# EAGLE design shiitakevmctl (EAGLE 8.2.1)
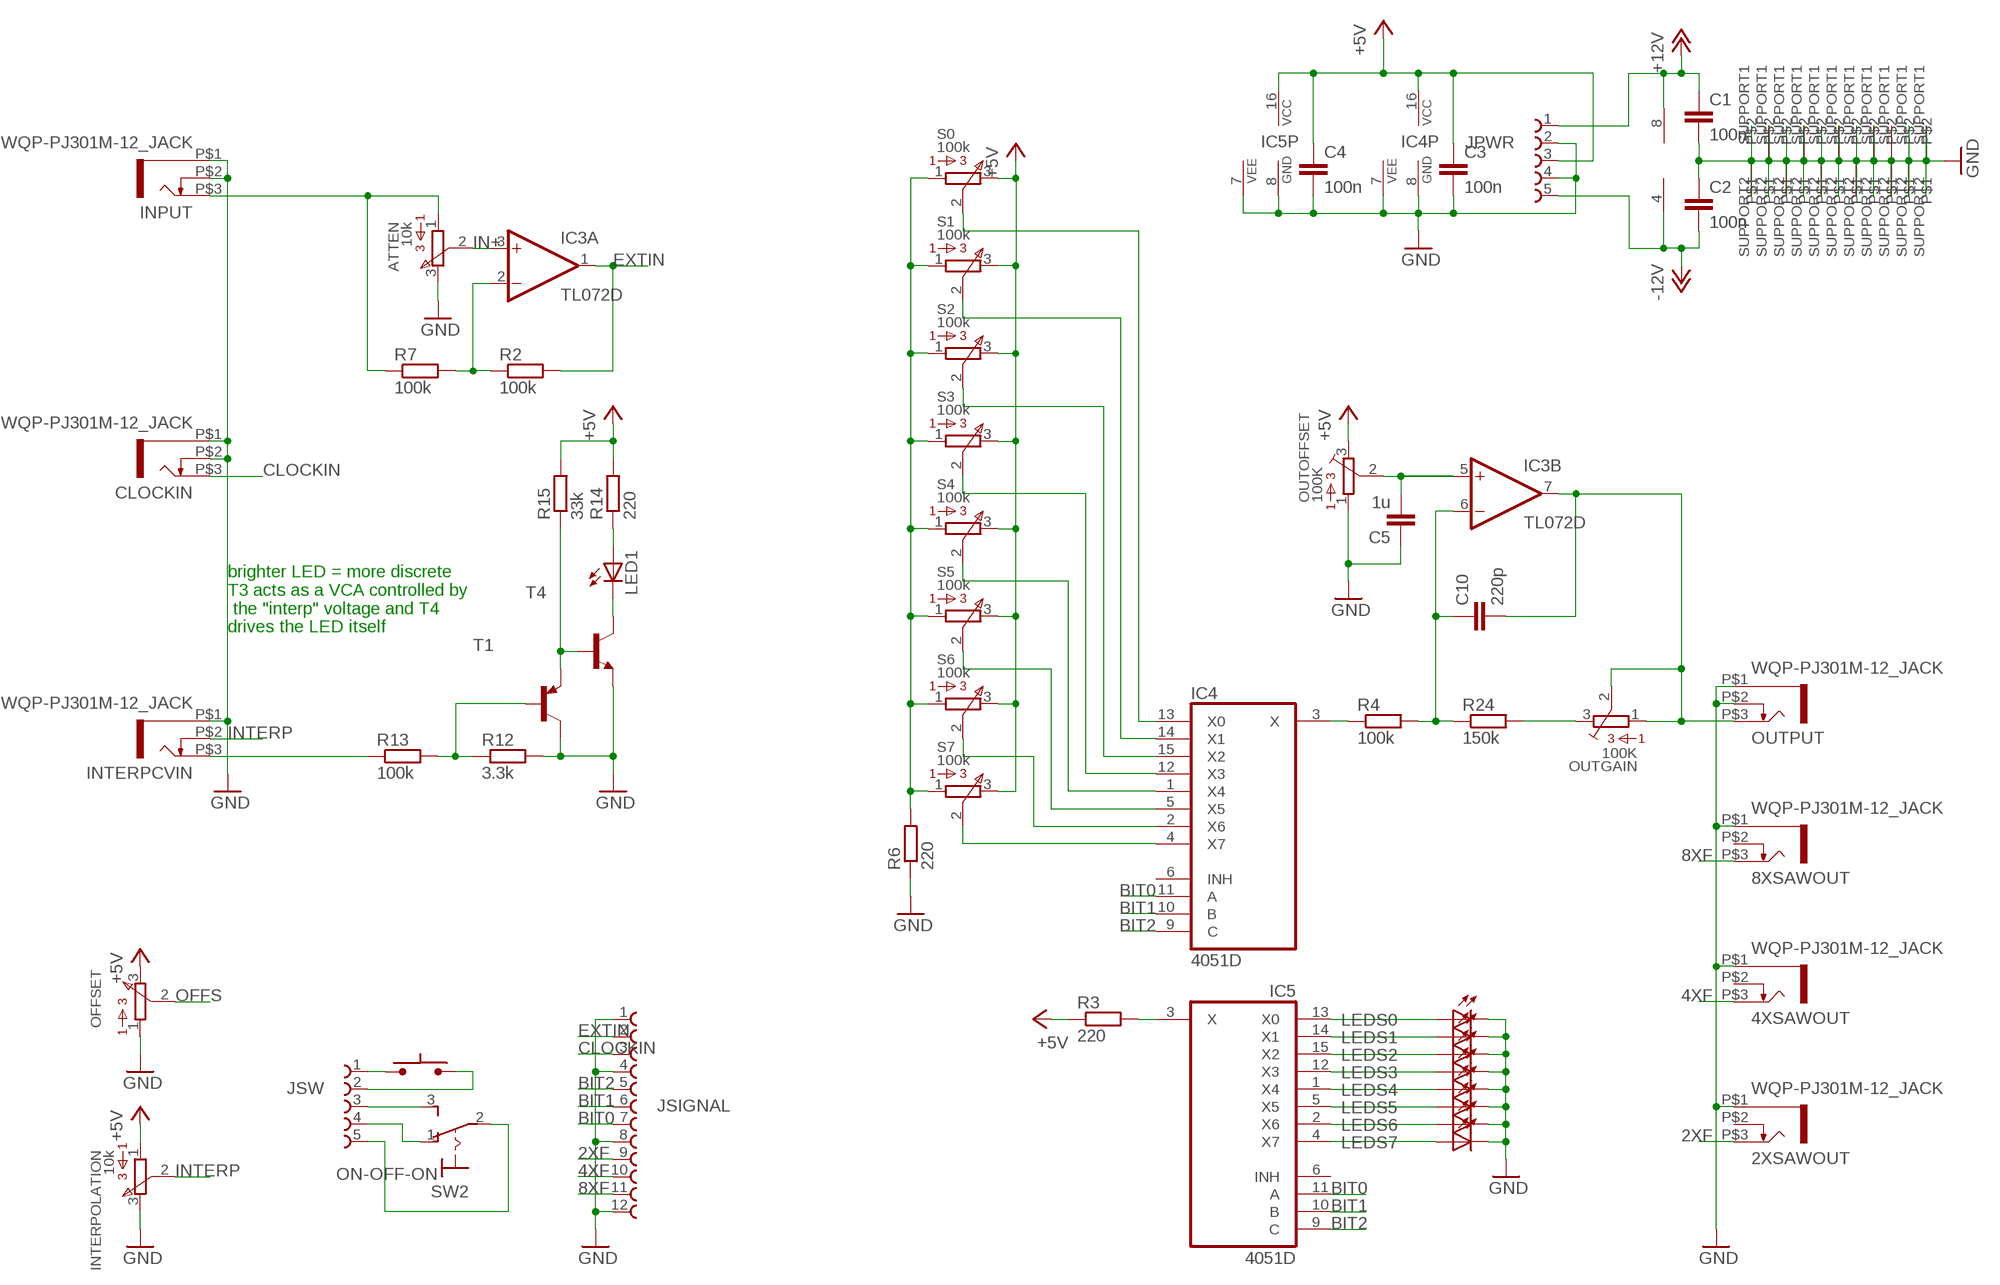
[diagram p0: schematic, sheet 1]

## Parts
2XSAWOUT  WQP-PJ301M-12_JACK  [WQP-PJ301M-12_JACK]
4XSAWOUT  WQP-PJ301M-12_JACK  [WQP-PJ301M-12_JACK]
8XSAWOUT  WQP-PJ301M-12_JACK  [WQP-PJ301M-12_JACK]
ATTEN  10k  308/309  [308]
C1  100n  C-EUC1206  [C1206]
C2  100n  C-EUC1206  [C1206]
C3  100n  C-EUC1206  [C1206]
C4  100n  C-EUC1206  [C1206]
C5  1u  C-EUC1206  [C1206]
C10  220p  C-EUC1206  [C1206]
CLOCKIN  WQP-PJ301M-12_JACK  [WQP-PJ301M-12_JACK]
IC3  TL072D  [SO08]
IC4  4051D  [SO16]
IC5  4051D  [SO16]
INPUT  WQP-PJ301M-12_JACK  [WQP-PJ301M-12_JACK]
INTERPCVIN  WQP-PJ301M-12_JACK  [WQP-PJ301M-12_JACK]
INTERPOLATION  10k  308/309  [308]
JPWR  61300511121  [61300511121]
JSIGNAL  61301211121  [61301211121]
JSW  61300511121  [61300511121]
LED1  LEDCHIPLED_0805  [CHIPLED_0805]
LEDS0  LED3MM  [LED3MM]
LEDS1  LED3MM  [LED3MM]
LEDS2  LED3MM  [LED3MM]
LEDS3  LED3MM  [LED3MM]
LEDS4  LED3MM  [LED3MM]
LEDS5  LED3MM  [LED3MM]
LEDS6  LED3MM  [LED3MM]
LEDS7  LED3MM  [LED3MM]
OFFSET  308/309  [308]
OUTGAIN  100K  3386-C  [3386C]
OUTOFFSET  100K  3386-C  [3386C]
OUTPUT  WQP-PJ301M-12_JACK  [WQP-PJ301M-12_JACK]
R2  100k  R-EU_R1206  [R1206]
R3  220  R-EU_R1206  [R1206]
R4  100k  R-EU_R1206  [R1206]
R6  220  R-EU_R1206  [R1206]
R7  100k  R-EU_R1206  [R1206]
R12  3.3k  R-EU_R1206  [R1206]
R13  100k  R-EU_R1206  [R1206]
R14  220  R-EU_R1206  [R1206]
R15  33k  R-EU_R1206  [R1206]
R24  150k  R-EU_R1206  [R1206]
S0  100k  308/309  [308]
S1  100k  308/309  [308]
S2  100k  308/309  [308]
S3  100k  308/309  [308]
S4  100k  308/309  [308]
S5  100k  308/309  [308]
S6  100k  308/309  [308]
S7  100k  308/309  [308]
SW1  PUSHSWITCH  [PUSHSWITCH]
SW2  ON-OFF-ON  320-916  [320-916]
T1  MMBT3906LT1-PNP-SOT23-BEC  [SOT23-BEC]
T4  MMBT3904LT1-NPN-SOT23-BEC  [SOT23-BEC]

## Nets
2XF: 2XSAWOUT.P$3 JSIGNAL.9
4XF: 4XSAWOUT.P$3 JSIGNAL.10
8XF: 8XSAWOUT.P$3 JSIGNAL.11
+5V: C3.1 C4.1 IC4.16(VCC) IC5.16(VCC) INTERPOLATION.1 JPWR.3 OFFSET.3 OUTOFFSET.3 R3.1 R14.2 R15.2 S0.3 S1.3 S2.3 S3.3 S4.3 S5.3 S6.3 S7.3
+12V: C1.1 IC3.8(P:V+) JPWR.1
-12V: C2.2 IC3.4(P:V-) JPWR.5
BIT0: IC4.11(A) IC5.11(A) JSIGNAL.7
BIT1: IC4.10(B) IC5.10(B) JSIGNAL.6
BIT2: IC4.9(C) IC5.9(C) JSIGNAL.5
CLOCKIN: CLOCKIN.P$3 JSIGNAL.3
EXTIN: IC3.1(A:OUT) JSIGNAL.2 R2.2
GND: 2XSAWOUT.P$1 4XSAWOUT.P$1 8XSAWOUT.P$1 ATTEN.3 ATTEN.SUPPORT2 C1.2 C2.1 C3.2 C4.2 C5.1 CLOCKIN.P$1 CLOCKIN.P$2 IC4.7(VEE) IC4.8(GND) IC5.7(VEE) IC5.8(GND) INPUT.P$1 INPUT.P$2 INTERPCVIN.P$1 INTERPOLATION.3 INTERPOLATION.SUPPORT1 INTERPOLATION.SUPPORT2 JPWR.2 JPWR.4 JSIGNAL.1 JSIGNAL.4 JSIGNAL.8 JSIGNAL.12 LEDS0.K(C) LEDS1.K(C) LEDS2.K(C) LEDS3.K(C) LEDS4.K(C) LEDS5.K(C) LEDS6.K(C) LEDS7.K(C) OFFSET.1 OFFSET.SUPPORT1 OFFSET.SUPPORT2 OUTOFFSET.1 OUTPUT.P$1 OUTPUT.P$2 R6.1 R12.2 S0.SUPPORT1 S0.SUPPORT2 S1.SUPPORT1 S1.SUPPORT2 S2.SUPPORT1 S2.SUPPORT2 S3.SUPPORT1 S3.SUPPORT2 S4.SUPPORT1 S4.SUPPORT2 S5.SUPPORT1 S5.SUPPORT2 S6.SUPPORT1 S6.SUPPORT2 S7.SUPPORT1 S7.SUPPORT2 T1.C T4.E
IN+: ATTEN.2 IC3.3(A:+IN)
INTERP: INTERPCVIN.P$2 INTERPOLATION.2
N$1: C10.1 IC3.6(B:-IN) R4.2 R24.1
N$2: C10.2 IC3.7(B:OUT) OUTGAIN.1 OUTGAIN.2 OUTPUT.P$3
N$3: ATTEN.1 INPUT.P$3 R7.1
N$4: IC4.13(X0) S0.2
N$5: IC4.14(X1) S1.2
N$6: IC4.15(X2) S2.2
N$7: IC4.12(X3) S3.2
N$8: IC4.1(X4) S4.2
N$9: IC4.5(X5) S5.2
N$10: IC4.2(X6) S6.2
N$11: IC4.4(X7) S7.2
N$12: IC4.3(X) R4.1
N$13: IC3.2(A:-IN) R2.1 R7.2
N$14: IC5.3(X) R3.2
N$15: R6.2 S0.1 S1.1 S2.1 S3.1 S4.1 S5.1 S6.1 S7.1
N$16: R15.1 T1.E T4.B
N$17: LED1.C T4.C
N$18: R12.1 R13.2 T1.B
N$19: INTERPCVIN.P$3 R13.1
N$20: LED1.A R14.1
N$21: JSW.1 SW1.P$1
N$22: JSW.2 SW1.P$2
N$23: JSW.4 SW2.1(O)
N$24: JSW.3 SW2.3(S)
N$25: JSW.5 SW2.2(P)
N$26: C5.2 IC3.5(B:+IN) OUTOFFSET.2
N$27: IC5.13(X0) LEDS0.A
N$28: IC5.14(X1) LEDS1.A
N$29: IC5.15(X2) LEDS2.A
N$30: IC5.12(X3) LEDS3.A
N$31: IC5.1(X4) LEDS4.A
N$32: IC5.5(X5) LEDS5.A
N$33: IC5.4(X7) LEDS7.A
N$34: IC5.2(X6) LEDS6.A
N$51: OUTGAIN.3 R24.2
OFFS: OFFSET.2
Unconnected: 2XSAWOUT.P$2 4XSAWOUT.P$2 8XSAWOUT.P$2 ATTEN.SUPPORT1 IC4.6(INH) IC5.6(INH)

## Notes on the sheet
- brighter LED = more discrete
  T3 acts as a VCA controlled by
   the "interp" voltage and T4
  drives the LED itself

## Library data of the parts
2XSAWOUT 4XSAWOUT 8XSAWOUT CLOCKIN INPUT INTERPCVIN OUTPUT = thonkiconn:WQP-PJ301M-12_JACK
ATTEN INTERPOLATION OFFSET S0 S1-S7 = bourns:308/309: 308/309 Series Potentiometer
C1-C5 C10 = resistor:C-EU: CAPACITOR, European symbol
IC3 = linear:TL072: OP AMP
IC4 IC5 = 40xx:4051: 8-channel ANALOG MULTIPLEXER
JPWR JSW = Board-to-Board (rev17e):61300511121: WR-PHD 2.54mm Pin Header, 5 Pin =>Code : Con_BTB_PHD_2.54_1_THT_61300511121 <http://katalog.we-online.de/media/images/eican/Con_BTB_PHD_2.54_1_THT_6130xx11121_pf2.jpg> Details see: http://katalog.we-online.de/en/em/613_0xx_111_21 Created 2014-05-29, Karrer Zheng 2014 (C) Würth Elektronik
JSIGNAL = Board-to-Board (rev17e):61301211121: WR-PHD 2.54mm Pin Header, 12 Pins =>Code : Con_BTB_PHD_2.54_1_THT_61301211121 <http://katalog.we-online.de/media/images/eican/Con_BTB_PHD_2.54_1_THT_6130xx11121_pf2.jpg> Details see: http://katalog.we-online.de/en/em/613_0xx_111_21 Created 2014-05-29, Karrer Zheng 2014 (C) Würth Elektronik
LED1 LEDS0 LEDS1-LEDS7 = led:LED: LED OSRAM: - CHIPLED LG R971, LG N971, LY N971, LG Q971, LY Q971, LO R971, LY R971 LH N974, LH R974 LS Q976, LO Q976, LY Q976 LO Q996 - Hyper CHIPLED LW Q18S LB Q993, LB Q99A, LB R99A - SideLED LS A670, LO A670, LY A670, LG A670, LP A670 LB A673, LV A673, LT A673, LW A673 LH A674 LY A675 LS A676, LA A676, LO A676, LY A676, LW A676 LS A679, LY A679, LG A679 - Hyper Micro SIDELED® LS Y876, LA Y876, LO Y876, LY Y876 LT Y87S - SmartLED LW L88C, LW L88S LB L89C, LB L89S, LG L890 LS L89K, LO L89K, LY L89K LS L896, LA L896, LO L896, LY L896 - TOPLED LS T670, LO T670, LY T670, LG T670, LP T670 LSG T670, LSP T670, LSY T670, LOP T670, LYG T670 LG T671, LOG T671, LSG T671 LB T673, LV T673, LT T673, LW T673 LH T674 LS T676, LA T676, LO T676, LY T676, LB T676, LH T676, LSB T676, LW T676 LB T67C, LV T67C, LT T67C, LS T67K, LO T67K, LY T67K, LW E67C LS E67B, LA E67B, LO E67B, LY E67B, LB E67C, LV E67C, LT E67C LW T67C LS T679, LY T679, LG T679 LS T770, LO T770, LY T770, LG T770, LP T770 LB T773, LV T773, LT T773, LW T773 LH T774 LS E675, LA E675, LY E675, LS T675 LS T776, LA T776, LO T776, LY T776, LB T776 LHGB T686 LT T68C, LB T68C - Hyper Mini TOPLED® LB M676 - Mini TOPLED Santana® LG M470 LS M47K, LO M47K, LY M47K Source: http://www.osram.convergy.de LUXEON: - LUMILED® LXK2-PW12-R00, LXK2-PW12-S00, LXK2-PW14-U00, LXK2-PW14-V00 LXK2-PM12-R00, LXK2-PM12-S00, LXK2-PM14-U00 LXK2-PE12-Q00, LXK2-PE12-R00, LXK2-PE12-S00, LXK2-PE14-T00, LXK2-PE14-U00 LXK2-PB12-K00, LXK2-PB12-L00, LXK2-PB12-M00, LXK2-PB14-N00, LXK2-PB14-P00, LXK2-PB14-Q00 LXK2-PR12-L00, LXK2-PR12-M00, LXK2-PR14-Q00, LXK2-PR14-R00 LXK2-PD12-Q00, LXK2-PD12-R00, LXK2-PD12-S00 LXK2-PH12-R00, LXK2-PH12-S00 LXK2-PL12-P00, LXK2-PL12-Q00, LXK2-PL12-R00 Source: www.luxeon.com KINGBRIGHT: KA-3528ASYC Source: www.kingbright.com
OUTGAIN OUTOFFSET = bourns:3386-: 3386 Series 3/8" Square Trimmer
R2-R4 R6 R7 R12-R15 R24 = resistor:R-EU_: RESISTOR, European symbol
SW1 = stuaiff:PUSHSWITCH: ON MOMENTARY PUSH SWITCH LIKE THE KIND FROM TAYDA
SW2 = switch:320-916: TOGGLE SWITCH distributor RS Components
T1 = transistor:*-PNP-: PNP Transistror
T4 = transistor:*-NPN-: NPN Transistror BF959 corrected 2008.03.06

## Board
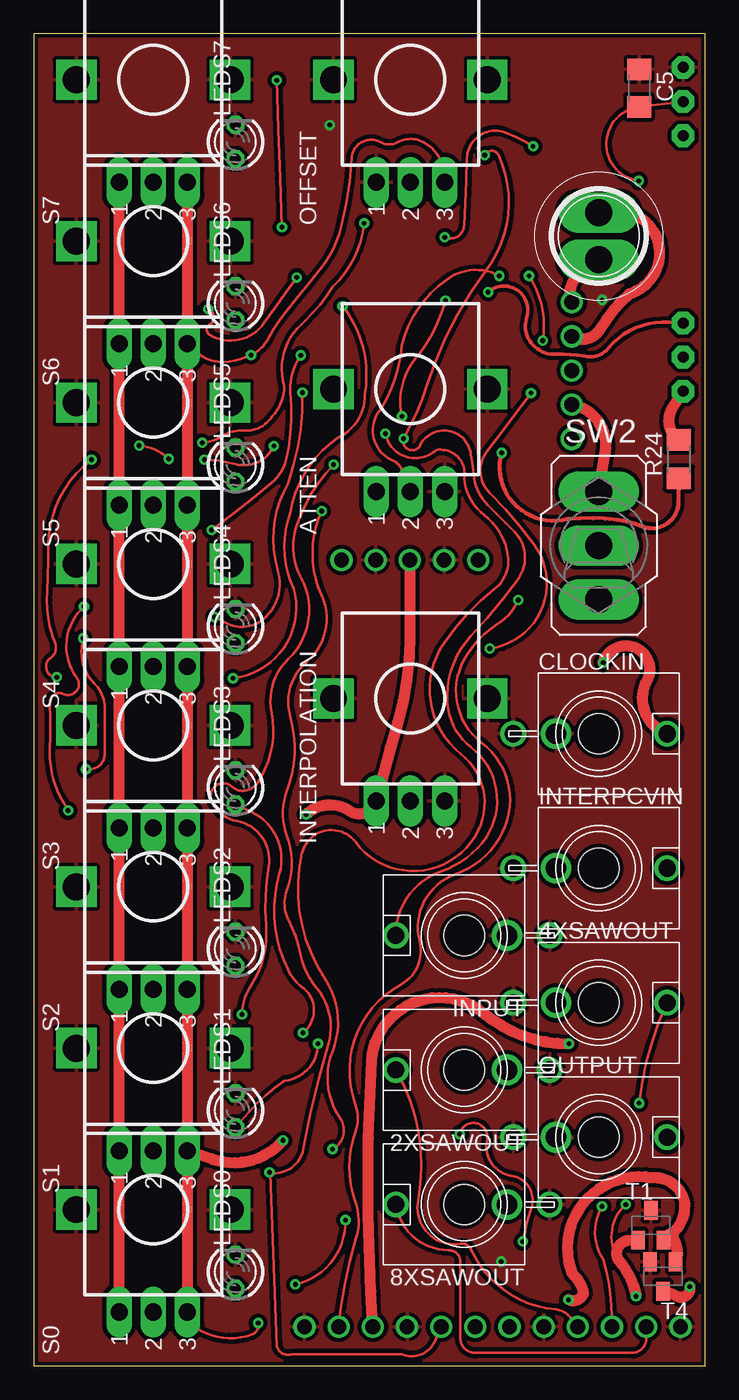
[diagram p1: board, top side]
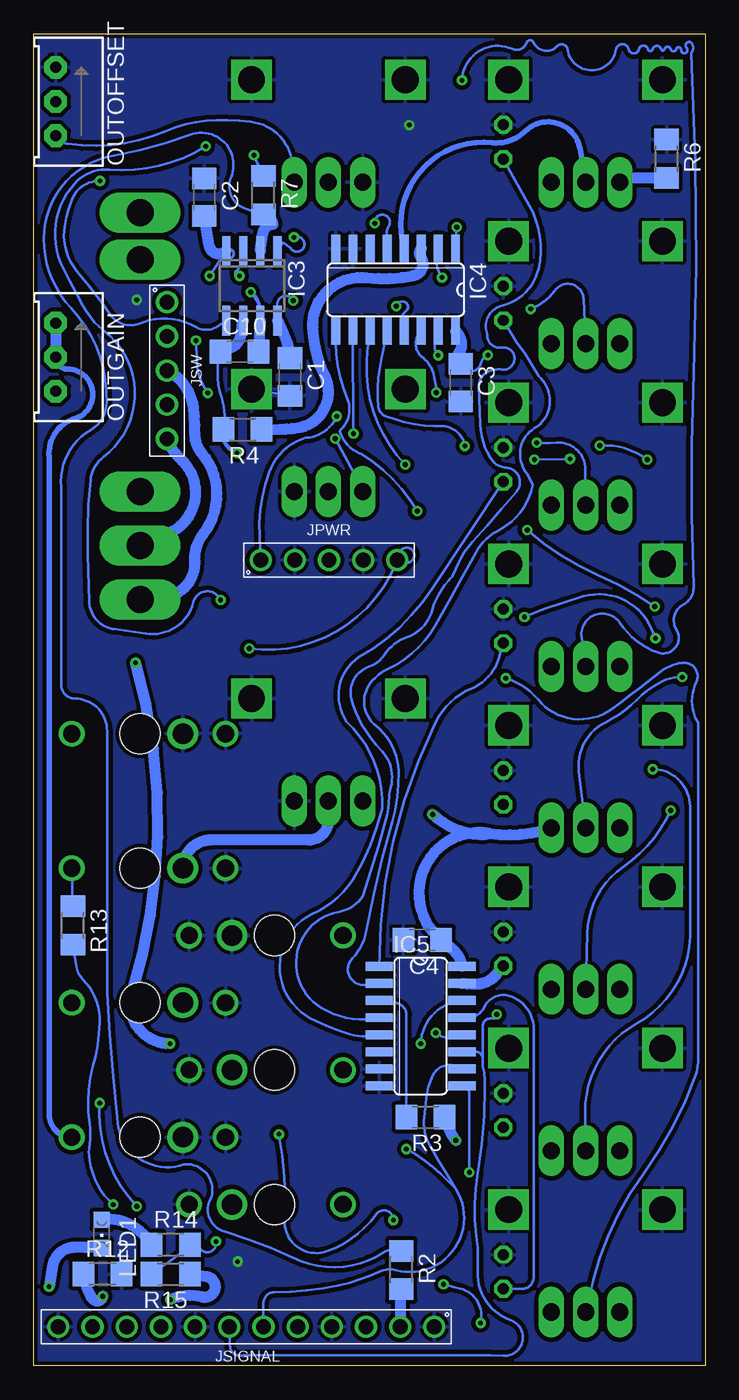
[diagram p2: board, bottom side, seen from below]

Size 49.91 x 99.05 mm. Coordinates in mm from the lower left corner, seen from the top.
Outline: 0,0 49.91,0 49.91,99.05 0,99.05 0,0
Copper layers (1*16): Top 0.035mm / dielectric 1.5mm / Bottom 0.035mm
Design rules "seeedincomplete": minimum track width 4mil, minimum drill 0.35mm, track to track 4mil, track to pad 4mil, pad to pad 4mil, via to via 12mil, smd to smd 4mil, copper to edge 0.3mm, drill to drill 6mil, minimum pad ring 10mil, minimum via ring 8mil, stop-mask expansion 4mil, vias tented up to drill 0mil, thermal gap 10mil

### Footprints (pad centres in the part's own frame; a part is rotated, then mirrored left to right if it is on the bottom)
WQP-PJ301M-12_JACK = drill 1.27 pad 1.905: P$1 0,-6.35; P$3 0,5.08 | drill 1.524 pad 2.286: P$2 0,-3.175 | hole 3: 0,0
308 = drill 1.27 long: 1 0,2.54; 2 0,0; 3 0,-2.54 | drill 2 square: SUPPORT1 7.62,5.715; SUPPORT2 7.62,-5.715
C1206 = smd 1.6 x 1.8: 1 -1.4,0; 2 1.4,0
SO08 = smd 0.6 x 2.2: 1 -1.905,-2.6; 2 -0.635,-2.6; 3 0.635,-2.6; 4 1.905,-2.6; 5 1.905,2.6; 6 0.635,2.6; 7 -0.635,2.6; 8 -1.905,2.6
SO16 = smd 0.66 x 2.032: 1 -4.445,-3.073; 2 -3.175,-3.073; 3 -1.905,-3.073; 4 -0.635,-3.073; 5 0.635,-3.073; 6 1.905,-3.073; 7 3.175,-3.073; 8 4.445,-3.073; 9 4.445,3.073; 10 3.175,3.073; 11 1.905,3.073; 12 0.635,3.073; 13 -0.635,3.073; 14 -1.905,3.073; 15 -3.175,3.073; 16 -4.445,3.073
61300511121 = drill 1.1: 1 -5.08,0; 2 -2.54,0; 3 0,0; 4 2.54,0; 5 5.08,0
61301211121 = drill 1.1: 1 -13.97,0; 2 -11.43,0; 3 -8.89,0; 4 -6.35,0; 5 -3.81,0; 6 -1.27,0; 7 1.27,0; 8 3.81,0; 9 6.35,0; 10 8.89,0; 11 11.43,0; 12 13.97,0
CHIPLED_0805 = smd 1.2 x 1.2: A 0,-1.05; C 0,1.05
LED3MM = drill 0.813 octagon: A -1.27,0; K 1.27,0
3386C = drill 0.813 pad 1.676 octagon: 1 2.54,1.27; 2 0,1.27; 3 -2.54,1.27
R1206 = smd 1.6 x 1.803: 1 -1.422,0; 2 1.422,0
PUSHSWITCH = drill 2 pad 2.2 long: P$1 0,1.75 | drill 2 pad 2.286 long: P$2 0,-1.75
320-916 = drill 2.007 long: 1 0,4.013; 2 0,0; 3 0,-4.013
SOT23-BEC = smd 1 x 1.4: B -0.95,-1.1; C 0,1.1; E 0.95,-1.1

### Placement (x,y rotation side)
2XSAWOUT  32,22 90 top
4XSAWOUT  42,27 270 top
8XSAWOUT  32,12 90 top
ATTEN  28,65 90 top
C1  30.86,73.52 270 bottom
C2  37.23,86.89 270 bottom
C3  18.17,73.11 270 bottom
C4  21.02,31.66 180 bottom
C5  45,95 270 top
C10  34.61,75.41 0 bottom
CLOCKIN  42,47 270 top
IC3  33.69,80.31 180 bottom
IC4  23,80 180 bottom
IC5  21.15,25.26 270 bottom
INPUT  32,32 90 top
INTERPCVIN  42,37 270 top
INTERPOLATION  28,42 90 top
JPWR  27.96,59.91 0 bottom
JSIGNAL  34.1,2.91 180 bottom
JSW  40,74 270 bottom
LED1  44.85,9.81 180 bottom
LEDS0  15,7 90 top
LEDS1  15,19 90 top
LEDS2  15,31 90 top
LEDS3  15,43 90 top
LEDS4  15,55 90 top
LEDS5  15,67 90 top
LEDS6  15,79 90 top
LEDS7  15,91 90 top
OFFSET  28,88 90 top
OUTGAIN  47,75 90 bottom
OUTOFFSET  47,94 90 bottom
OUTPUT  42,17 270 top
R2  22.59,7.13 270 bottom
R3  20.79,18.5 180 bottom
R4  34.38,69.62 180 bottom
R6  2.87,89.75 270 bottom
R7  32.83,87.04 270 bottom
R12  44.8,6.83 0 bottom
R13  46.99,32.74 270 bottom
R14  39.72,9.01 0 bottom
R15  39.72,6.83 180 bottom
R24  47.95,67.41 90 top
S0  8.89,4 90 top
S1  8.89,16 90 top
S2  8.89,28 90 top
S3  8.89,40 90 top
S4  8.89,52 90 top
S5  8.89,64 90 top
S6  8.89,76 90 top
S7  8.89,88 90 top
SW1  42,84 180 top
SW2  42,61 0 top
T1  45.87,10.46 0 top
T4  46.77,6.65 180 top

### Tracks (layer width: path | path; a pad name or v marks a point on that pad's centre or on a via)
2XF
  Top 0.203: JSIGNAL.9 39.83,3.67 arc46 38.82,4.2 arc-61 32.5,8.66 arc75 31.71,9.08 arc-110 28.57,12.27 arc40 2XSAWOUT.P$3
4XF  (via drill 0.35)
  Top 0.203: JSIGNAL.10 42.91,4.51 arc14 42.33,7.92 arc-65 v42.25,11.86 | v45,19.54 arc-19 4XSAWOUT.P$3
  Bottom 0.203: v42.25,11.86 arc48 v45,19.54
8XF
  Top 0.203: JSIGNAL.11 45.53,2.03 arc-90 44.45,0.96 32.82,0.96 arc-90 31.71,2.07 31.71,7.75 arc90 30.86,8.61 arc-82 8XSAWOUT.P$3
+5V  (via drill 0.35)
  Top 0.203: S0.3 arc56 12.06,2.83 arc54 16.24,2.34 arc84 v16.69,3.19 | v19.45,6.06 arc79 v23.17,10.85 | v31.68,17.23 arc-182 33.7,16.8 arc95 35.5,14.14 arc-100 36.99,11.7 arc9 v36.35,9.25 | S6.3 12.31,75.25 arc43 14.1,74.64 arc23 v16.15,75.15 arc37 17.43,76.38 arc-11 18.71,78.32 arc0 21.28,81.5 arc25 22.87,84.73 arc10 23.64,89.8 arc-115 25.79,90.98 arc58 27.07,90.98 arc-55 28.87,91.03 arc-71 OFFSET.3
  Top 0.813: S7.3 arc90 S7.3 11.42,85.19 arc-90 11.43,85.18 S6.3 S5.3 S4.3 S3.3 S2.3 S1.3 | JPWR.3 27.97,54.35 arc-16 27.05,47.84 arc2 INTERPOLATION.1 arc-110 23.5,41.25 arc77 v20.25,41 | S1.3 S0.3 | S1.3 13.22,15.4 arc69 v18.54,16.76
  Bottom 0.203: R15.2 39.89,7.68 arc-11 R14.2 arc96 37.63,8.82 arc-164 v36.35,9.25 | R3.1 arc59 19.32,18.72 | v16.69,3.19 arc-89 18.18,5.74 arc-2 v19.45,6.06 | v23.17,10.85 arc-146 24.45,11.27 arc36 28.17,8.51 arc112 31.25,10.85 arc-14 v31.68,17.23 | C3.1 arc-150 16.66,74.53 arc51 v16.15,75.15 | OFFSET.3 30.69,89.41 arc-78 33.77,92.49 arc-6 36.32,92.61 arc-23 40.08,91.81 arc32 47.38,90.86 arc51 OUTOFFSET.3
  Bottom 0.813: IC5.16 arc-43 18.8,30.99 C4.1 arc150 16.09,39.6 | 16.09,39.6 arc-28 S3.3 | C3.1 18.37,75.21 arc-90 IC4.16 | v18.54,16.76 arc19 R3.1 | v20.25,41 arc-39 16.75,39.5 arc-24 16.09,39.6
+12V  (via drill 0.35)
  Top 0.203: v27.38,70.59 arc-56 28.65,75.21 arc21 v30.61,79.19
  Bottom 0.203: JPWR.1 33.12,61.68 arc23 32.41,66.44 arc54 29.69,69 arc-63 v27.38,70.59 | v30.61,79.19 arc-155 31.79,78.94 arc-1 IC3.8
  Bottom 0.813: IC3.8 31.39,76.86 arc20 C1.1
-12V  (via drill 0.35)
  Top 0.203: v36.81,81.04 arc-42 v37.84,76.22 | v36.97,72.33 arc-1 33.69,67.98 arc83 33.89,64.9 arc-9 37.17,61.11 arc-119 v33.89,53.33
  Bottom 0.203: 35.43,82.37 arc-240 IC3.4 v36.81,81.04 | v37.84,76.22 37.79,74.69 arc-35 v36.97,72.33 | v33.89,53.33 arc-80 22.71,60.45 arc244 22.1,59.73 arc43 JPWR.5
  Bottom 0.813: C2.2 36.86,83.29 arc-128 IC3.4
BIT0  (via drill 0.35)
  Top 0.203: v15.48,26.12 arc-33 16.1,28.17 arc38 17.28,32.78 arc-14 17.47,37.13 arc89 15.12,40.51 arc-53 13.24,41.91 arc-158 14.74,43.07 arc96 16.57,43.28 arc47 17.68,48.57 arc-58 18.92,52.54 arc75 19.86,58.65 arc-47 19.52,62.4 arc-26 v22.3,67.01
  Bottom 0.203: JSIGNAL.7 35.32,1.49 arc-110 34.26,0.8 17.96,0.8 | 17.96,0.8 17.63,0.8 | 16.52,22.28 16.52,22.18 | 16.52,22.28 16.52,22.79 | 16.52,22.79 arc-90 17.1,23.37 18.06,23.37 arc-90 IC5.11 | 16.52,22.79 16.52,25.3 arc90 16,25.82 15.79,25.82 arc-90 v15.48,26.12 | v22.3,67.01 arc47 25.16,74.65 arc7 IC4.11 | 16.52,22.28 arc10 16.37,20.73 arc10 16.9,14.36 arc-17 17.01,9.68 arc10 16.9,7.02 arc-73 14.46,3.4 arc164 14.99,0.74 arc-5 17.96,0.8
BIT1  (via drill 0.35)
  Top 0.203: v22.21,16.12 arc97 22.78,18.4 arc-56 22.21,23.39 arc55 21.64,28.82 arc-46 19.93,38.09 arc-130 23.92,38.94 arc117 33.03,39.8 arc78 31.75,45.5 arc-86 30.5,53.75 arc-18 34.25,57.75 arc60 35.25,60.25 arc44 33.5,63.25 arc-47 32,66 arc112 29.91,68.08 arc-121 v26.14,69.31
  Bottom 0.203: JSIGNAL.6 32.83,4.67 arc90 32.03,5.47 arc-13 27.19,6 arc-12 24.22,7.01 arc40 22.94,7.12 arc-40 20.29,7.33 arc-97 18.54,13.17 | 18.54,13.17 arc2 20.5,16.47 arc38 20.87,18.48 arc-5 20.77,19.49 arc20 20.29,21.51 arc104 IC5.10 | 18.54,13.17 19.65,14.27 arc-17 v22.21,16.12 | IC4.10 v26.14,69.31
BIT2  (via drill 0.35)
  Top 0.203: JSIGNAL.5 29.8,1.81 arc-88 27.41,0.85 19.17,0.85 arc-90 18.07,1.46 17.58,14.34 | 17.58,14.34 arc90 v17.53,14.39 | v21.41,63.56 arc49 21.41,57.27 arc-74 20.3,52.35 arc66 19.07,48.28 arc-37 18.82,42.74 arc42 18.82,39.41 arc-42 18.82,35.35 arc49 18.95,33.13 arc-17 19.81,30.67 arc29 21.04,28.08 arc-57 21.9,23.89 arc7 20.05,16.14 arc-88 17.58,14.34
  Bottom 0.203: v17.53,14.39 17.53,20.26 arc-90 IC5.9 | v21.41,63.56 arc-29 25.54,67.78 arc52 27.16,69.5 arc30 26.92,69.77 arc-58 26.56,71.82 arc27 IC4.9
CLOCKIN  (via drill 0.35)
  Top 0.813: JSIGNAL.3 25.07,5.52 arc-7 25.12,22.63 arc-126 33.41,26.24 arc39 v39.78,23.96 | v42.33,52.27 arc-193 45.57,50.94 arc99 CLOCKIN.P$3
  Bottom 0.813: v39.78,23.96 arc107 42.59,27.78 arc-16 40.68,39.36 arc-18 v42.33,52.27
EXTIN  (via drill 0.35)
  Top 0.203: JSIGNAL.2 22.84,4.3 arc-10 23.96,9.46 arc37 23.9,12.22 arc-39 23.9,17.37 arc39 23.9,19.44 arc-81 27.3,28.36 arc76 28.68,31.55 arc-85 31.34,36.55 arc49 35.06,40.16 arc74 33.31,46.32 arc-82 31.98,52.48 arc-29 34.48,55.14 arc35 v36.02,56.94 | v37.12,90.67 arc11 35.07,91.69 arc110 32.2,89.75 arc-3 32,84.78 arc-109 v30.56,83.91
  Bottom 0.203: IC3.1 31.38,83.5 arc26 30.76,83.04 arc-253 v30.56,83.91 | v36.02,56.94 arc-143 38.03,56.78 arc85 41.59,54.45 arc-3 43.88,54.77 arc82 45.79,56.84 arc0 45.9,60.29 arc8 45.68,65.87 arc47 44.73,67.57 arc-105 44.66,76.94 arc24 46.25,78.84 arc0 47.69,81.55 arc46 48.04,85.86 arc23 46.86,87.9 arc53 44.3,88.93 arc-37 v37.12,90.67
  Bottom 0.813: JSIGNAL.2 R2.2
GND  (via drill 0.35)
  Bottom 0.203: C1.2 ATTEN.SUPPORT2
  other vias: 22,92.25 42.25,79.25 34.75,7.75
  pour Bottom (isolate 0.305): 50,99 0,99 0,0 50,0
  pour Top (isolate 0.305): 0,99 50,99 50,0 0,0
IN+  (via drill 0.35)
  Top 0.203: ATTEN.2 27.38,66.59 arc48 26.62,67.36 arc-108 25.84,71.17 arc27 27.37,75.89 arc-41 30.66,80.73 arc-67 v34.61,81.04
  Bottom 0.203: v34.61,81.04 arc167 34.87,81.4 arc-56 IC3.3
INTERP
  Bottom 0.813: INTERPOLATION.2 28,40.57 arc90 29.48,39.09 36.73,39.09 arc-90 INTERPCVIN.P$2
N$1  (via drill 0.35)
  Top 0.305: R24.1 47.91,64.17 arc-111 45.2,62.41 arc16 43.39,62.89 arc12 39.67,62.95 arc-120 v34.79,67.89
  Bottom 0.203: R4.2 arc-31 35.94,71.97 arc36 C10.1
  Bottom 0.305: v34.79,67.89 arc85 R4.2
  Bottom 0.813: C10.1 35.27,75.69 arc-59 34.52,76.6 arc1 IC3.6
N$2  (via drill 0.35)
  Top 0.254: OUTGAIN.1 47.22,77.61 arc54 42.75,75.69 arc-61 40.95,75.06 arc14 38.77,75.22 arc-110 36.65,77.98 arc149 v33.78,79.84
  Bottom 0.254: v33.78,79.84 arc59 IC3.7
  Bottom 0.406: OUTGAIN.2 arc-90 47.38,74.1 arc163 46.84,70.44 arc-79 48.76,67.57 48.76,18.68 arc-90 OUTPUT.P$3
  Bottom 0.813: IC3.7 C10.2 | OUTGAIN.1 OUTGAIN.2
N$3  (via drill 0.35)
  Top 0.203: v33.53,90 arc-131 34.56,90 arc-61 33.64,81.45 arc19 29.23,72.89 arc-12 v27.5,68.94 arc177 28.75,68.5 arc-146 32.5,67.75 arc-2 32.75,66 arc39 33.75,64 arc-2 35.75,62 arc-80 36,58.5 arc-7 32.5,54.25 arc48 30.75,49.25 arc48 32.5,46 arc-97 33,38.5 arc-26 30.25,36.75 arc71 INPUT.P$3
  Bottom 0.203: R7.1 v33.53,90 | v27.5,68.94 arc5 ATTEN.1
N$4  (via drill 0.35)
  Top 0.203: v14.82,51.12 arc99 19.33,57.78 arc-45 19.07,63.42 arc-46 22.61,69 arc68 24.61,72.23 arc48 v22.96,78.79
  Bottom 0.203: S0.2 8.31,6.35 arc22 4.62,14.24 arc-17 0.72,21.62 arc-20 0.51,22.85 0.51,47.84 arc18 0.77,48.29 arc46 0.66,50.84 arc-121 1.66,52.27 arc-34 3.31,51.61 arc1 4.86,50.39 arc2 6.97,48.82 arc86 12.41,49.53 arc-34 v14.82,51.12 | v22.96,78.79 arc184 22.1,78.58 arc-89 IC4.13
N$5  (via drill 0.35)
  Top 0.203: v3.9,44.36 4.15,44.36 arc90 5.28,45.49 5.28,48.92 arc37 4.77,50.46 arc-65 v3.69,54.09 | v13.43,55.68 arc-7 14.25,55.27 arc69 17.02,55.48 arc71 18.1,59.27 arc-44 18.91,65.63 arc20 v19.98,72.36
  Bottom 0.203: S1.2 8.92,18.85 arc62 5.08,25.46 arc-64 1.13,32.63 1.13,41.59 arc-90 v3.9,44.36 | v19.98,72.36 arc-11 20.12,73.49 arc-44 20.97,74.94 arc103 IC4.14 | v3.69,54.09 4,54.81 arc-82 9.02,57.22 arc-7 v13.43,55.68
N$6  (via drill 0.35)
  Top 0.203: v13.23,62.14 arc5 17.88,65.83 arc25 18.75,67.27 arc18 19.07,72.38 arc-36 v19.85,75.12 | v2.56,41.29 2.1,42.1 arc-32 1.21,45.75 arc5 1.21,49.29 arc-118 2.21,49.95 arc152 3.2,51.17 arc-85 v3.74,56.45
  Bottom 0.203: S2.2 8.77,32.17 arc54 6.1,37.09 arc-30 v2.56,41.29 | v3.74,56.45 arc-11 7.9,58.76 arc17 v13.23,62.14 | v19.85,75.12 arc62 20.05,76.12 arc-21 IC4.15
N$7  (via drill 0.35)
  Top 0.203: v1.71,51.21 arc-147 1.27,52.64 arc77 1.6,53.69 arc-25 0.99,57.61 arc3 1.1,60.98 arc-53 v4.31,67.38 | v7.84,68.42 arc-40 v10.05,67.43 | v12.7,67.38 arc-13 14.79,67.1 arc85 v17.86,68.39
  Bottom 0.203: S3.2 9.38,44.2 arc71 7.4,47.85 arc-19 5.08,49.51 arc16 3.42,50.77 arc30 v1.71,51.21 | v4.31,67.38 arc-41 v7.84,68.42 | v10.05,67.43 v12.7,67.38 | v17.86,68.39 arc-74 19.37,69.86 arc24 23.79,70.63 arc62 24.29,71.29 arc19 24.07,74.83 arc-3 IC4.12
N$8  (via drill 0.35)
  Top 0.203: v18.08,95.57 arc1 v18.46,84.66
  Bottom 0.203: S4.2 9.18,54.17 arc154 6.34,55.23 arc-38 3.49,53.03 arc-141 2.14,54.74 arc94 1.64,56.59 arc-64 0.85,57.94 arc4 0.85,73.81 arc-5 1.05,97.58 arc-70 0.97,98.3 arc-196 1.38,98 arc228 1.79,97.84 arc-171 2.15,97.89 arc155 2.56,97.89 arc-155 3.02,97.89 arc155 3.28,97.89 arc-155 3.9,97.89 arc155 4.26,97.89 arc-155 4.92,97.89 arc155 5.69,97.89 arc-158 6.63,97.86 arc167 10.25,98 arc-107 11.02,98.1 arc114 12.77,98.41 arc-138 13.26,98.39 arc95 14.36,97.91 arc-112 v18.08,95.57 | IC4.1 v18.46,84.66
N$9  (via drill 0.35)
  Top 0.203: v12.53,68.64 arc28 14.01,69.13 arc-37 15.66,69.54 arc64 17.72,70.61 arc45 18.63,72.83 arc-69 20.19,77.69 arc13 22.25,80.25 arc41 v24.56,84.95
  Bottom 0.203: S5.2 8.9,66.66 arc-94 11.04,68.64 arc9 v12.53,68.64 | v24.56,84.95 arc213 23.48,84.78 arc-57 23.57,83.63 arc63 IC4.5
N$10  (via drill 0.35)
  Top 0.203: v12.97,78.58 arc-128 13.07,77.41 arc118 13.07,76.66 arc86 17.11,77.52 arc-1 v19.56,80.92
  Bottom 0.203: S6.2 9.04,79.32 arc-142 11.16,79.96 arc33 v12.97,78.58 | v19.56,80.92 arc59 IC4.2
N$11
  Bottom 0.406: S7.2 9.29,90.46 arc-125 13.38,91.79 arc51 15.83,90.94 arc-113 IC4.4
N$12
  Bottom 0.813: R4.1 31.55,69.64 arc-8 30.27,69.74 arc-107 28.25,73.57 arc23 29.16,77.23 arc39 28.47,79.47 arc60 25.17,80.9 arc-18 21.67,81.06 arc-115 21.14,82.44 arc80 IC4.3
N$13
  Bottom 0.203: R7.2 arc13 34.33,86.11 arc88 35.24,88.39 arc-133 38.27,91.52 arc11 43.95,89.98 arc-75 49.11,84.41 arc-48 47.14,78.67 arc45 44.49,71.6 arc58 45.68,69.58 arc-65 47.86,65.33 47.86,50.62 arc-90 46.85,49.61 arc90 44.45,47.21 44.45,27.73 arc-3 43.69,18.42 arc-109 38.74,14.99 arc127 36.9,12.11 arc-90 35.73,9.99 arc9 30.63,8.02 arc-59 23.88,8.45 arc56 R2.1
  Bottom 0.813: IC3.2 32.88,84.19 arc78 32.13,84.88 arc-70 R7.2
N$14
  Bottom 0.203: R3.2 22.21,26.09 arc-90 23.1,26.98 24.05,26.98 arc90 IC5.3
N$15
  Top 0.813: S0.1 S1.1 S2.1 S3.1 S4.1 S5.1 S6.1 S7.1
  Bottom 0.813: S7.1 arc90 6.03,88.32 R6.2
N$16  (via drill 0.35)
  Top 0.813: T4.B arc60 47.28,9.84 T1.E arc70 48.36,12.24 arc81 45.97,14 arc122 40.08,6.79 arc-35 40.88,5.43 arc-98 v39.75,4.92
  Bottom 0.813: R15.1 37.09,6.66 arc187 37.4,5.12 arc-39 v39.75,4.92
N$17  (via drill 0.35)
  Top 0.813: v48.77,5.89 arc-130 47.79,5.17 arc17 T4.C
  Bottom 0.813: v48.77,5.89 arc-3 48.51,7.38 arc80 46.92,8.81 arc4 46.05,8.81 LED1.C arc223 44.87,8.71
N$18  (via drill 0.35)
  Top 0.203: v44,12 arc82 43.49,7.84
  Top 0.813: T1.B 44.05,9.29 arc111 43.49,7.84 arc-31 v44.77,5.17
  Bottom 0.203: R13.2 46.75,29.75 arc-36 46.25,28.75 arc47 45,25.5 arc13 45.5,22.25 arc-24 45.75,18 arc17 45.75,16.5 arc-17 45.75,15.25 arc-40 v44,12
  Bottom 0.813: v44.77,5.17 arc137 45.54,5.02 arc25 R12.1
N$19
  Bottom 0.203: INTERPCVIN.P$3 R13.1
N$20
  Bottom 0.813: R14.1 41.6,9.58 arc-60 LED1.A
N$21
  Top 0.813: SW1.P$1 40.52,81.11 arc76 JSW.1
N$22
  Top 0.813: SW1.P$2 44.72,85.57 arc-137 44.25,79.68 arc17 42.12,77.12 arc-93 JSW.2
N$23
  Top 0.813: SW2.1 42.49,67.94 arc89 JSW.4
N$24
  Bottom 0.813: SW2.3 40.26,57.16 arc-87 37.92,59.86 arc41 37.28,61.88 arc-78 37.39,67.83 arc41 37.92,69.32 arc-8 38.03,71.23 arc-57 JSW.3
N$25
  Bottom 0.813: SW2.2 39.83,61.94 arc-113 38.88,67.3 arc23 JSW.5
N$26  (via drill 0.35)
  Top 0.203: OUTOFFSET.2 C5.2 arc166 v44.98,88.1
  Bottom 0.203: IC3.5 36.15,77.35 arc68 37.89,77.25 arc-54 42.15,77.45 arc70 44.09,78.02 arc-5 46.71,81.4 arc35 47.69,84.01 arc17 47.09,86.66 arc71 v44.98,88.1
N$27
  Bottom 0.203: LEDS0.A 13.6,5.73 arc-90 12.75,6.59 12.75,25.07 arc-73 14.56,27.51 arc-81 16.41,26.69 arc78 IC5.13 arc90 17.94,26.03
N$28  (via drill 0.35)
  Top 0.203: LEDS1.A 15.99,18.86 arc-15 18.64,21.19 arc84 v21.14,23.96
  Bottom 0.203: v21.14,23.96 arc83 IC5.14
N$29
  Bottom 0.813: LEDS2.A 15.52,29.1 arc48 16.96,28.38 arc10 IC5.15
N$30  (via drill 0.35)
  Top 0.203: LEDS3.A 16.2,41.17 arc-81 18.27,36.6 arc42 18.91,29.43 arc27 19.97,28.15 arc-105 v20.02,24.75
  Bottom 0.203: v20.02,24.75 arc-69 IC5.12
N$31
  Bottom 0.203: LEDS4.A 15.35,52.59 arc50 17.37,50.36 arc-41 20.02,47.86 arc-26 IC5.1
N$32
  Bottom 0.203: LEDS5.A 20.29,57.79 arc28 25.76,52.69 arc-89 26.66,47.91 arc50 24.01,41.43 arc17 26.18,36.14 arc34 29.26,33.57 arc-130 28.95,25.66 arc-10 26.4,24.65 arc-31 IC5.5
N$33
  Bottom 0.203: LEDS7.A 13.06,86.26 arc42 12.38,81.59 arc64 15.08,78.83 arc-98 16.2,76.7 arc-104 15.13,75.71 arc198 15.13,74.07 arc-43 16.3,73.82 arc-57 16.82,72.84 arc-2 16.73,69.99 arc-35 15.72,67.19 arc-41 14.77,66.77 arc127 14.02,65.02 arc2 17.31,61.24 arc-21 18.54,59.23 arc23 19.07,58.38 arc-28 20.29,56.2 arc55 22.15,54.18 arc-36 23.85,52.85 arc38 24.96,52 arc-85 26.29,49.61 arc-21 25.23,47.22 arc-8 24.01,45.68 arc58 23.37,43.03 arc-13 23.48,42.34 arc13 23.74,40.58 arc3 25.44,34.9 arc46 27.19,33.77 arc-139 28.53,26.61 arc-43 IC5.4
N$34
  Bottom 0.203: LEDS6.A 14.02,76.06 arc10 12.38,73.61 arc108 12.69,69.71 arc-93 13.36,66.49 arc14 12.82,65.48 arc53 15.51,62.04 arc-31 17.05,60.45 arc2 20.08,55.03 arc35 23.53,51.84 arc-22 24.75,50.94 arc-94 24.48,47.59 arc50 22.78,44.19 arc18 23.26,40.42 arc-5 25.17,32.35 arc33 26.24,30.28 arc-134 25.39,28.31 arc-11 IC5.2
N$51
  Top 0.813: OUTGAIN.3 47.48,71.23 arc88 R24.2